# Altium schematic sheet MAIN.SchDoc: SpaceLocator
size A4; Author: 罗琪; Engineer: 罗琪
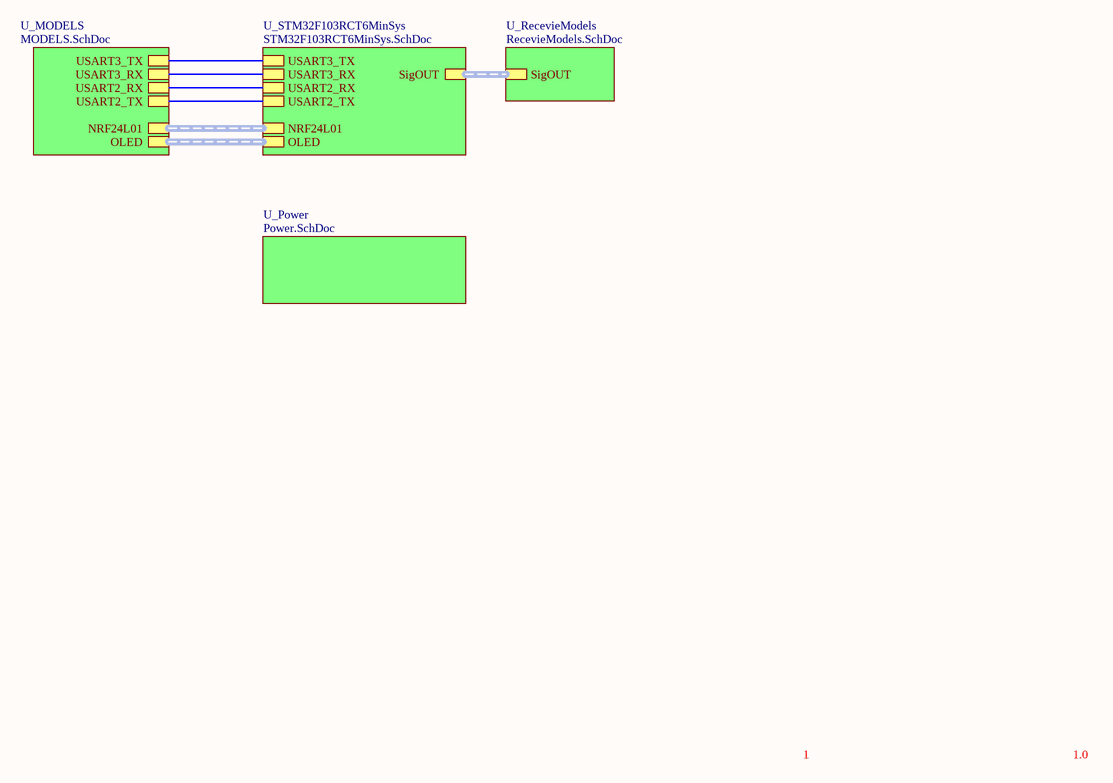
[diagram p0: MAIN.SchDoc]

## Sub-sheets
U_MODELS = MODELS.SchDoc: NRF24L01 (harness NRF24L01), USART2_TX, USART2_RX, USART3_RX, USART3_TX, OLED (harness OLED)
U_Power = Power.SchDoc: no entries
U_RecevieModels = RecevieModels.SchDoc: SigOUT (harness SigOUT)
U_STM32F103RCT6MinSys = STM32F103RCT6MinSys.SchDoc: USART2_TX, USART2_RX, USART3_RX, USART3_TX, NRF24L01 (harness NRF24L01), SigOUT (harness SigOUT), OLED (harness OLED)

## Nets
(unnamed): sheet U_MODELS/USART2_TX, sheet U_STM32F103RCT6MinSys/USART2_TX
(unnamed): sheet U_MODELS/USART2_RX, sheet U_STM32F103RCT6MinSys/USART2_RX
(unnamed): sheet U_MODELS/USART3_RX, sheet U_STM32F103RCT6MinSys/USART3_RX
(unnamed): sheet U_MODELS/USART3_TX, sheet U_STM32F103RCT6MinSys/USART3_TX

## Buses and harness runs
harness sheet U_MODELS/NRF24L01 = sheet U_STM32F103RCT6MinSys/NRF24L01
harness sheet U_MODELS/OLED = sheet U_STM32F103RCT6MinSys/OLED
harness sheet U_RecevieModels/SigOUT = sheet U_STM32F103RCT6MinSys/SigOUT

## Notes on the sheet
- 1
- 1.0